# Altium schematic sheet PCB_tete_v1.SchDoc
size A4
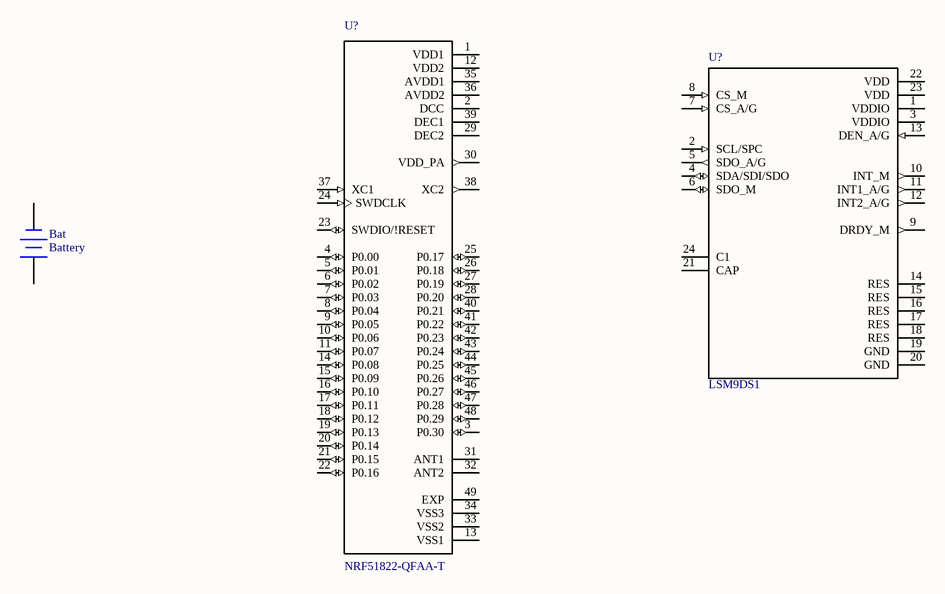
[diagram p0: PCB_tete_v1.SchDoc]

## Parts
(Parts that share a designator on the sheet are numbered #1, #2 ... from top to bottom, then left to right.)
Bat  Battery  [BAT-2]
U?#1  LSM9DS1  [PQFN24P43_350X300X102L35X23N]
U?#2  NRF51822-QFAA-T  [QFN40P600X600X90-49N]

## Nets

Not connected (* = marked no-connect by the designer): Bat 1(+) 2(-); U?#1 1(VDDIO) 2(SCL/SPC) 3(VDDIO) 4(SDA/SDI/SDO) 5(SDO_A/G) 6(SDO_M) 7(CS_A/G) 8(CS_M) 9(DRDY_M) 10(INT_M) 11(INT1_A/G) 12(INT2_A/G) 13(DEN_A/G) 14(RES) 15(RES) 16(RES) 17(RES) 18(RES) 19(GND) 20(GND) 21(CAP) 22(VDD) 23(VDD) 24(C1); U?#2 1(VDD1) 2(DCC) 3(P0.30) 4(P0.00) 5(P0.01) 6(P0.02) 7(P0.03) 8(P0.04) 9(P0.05) 10(P0.06) 11(P0.07) 12(VDD2) 13(VSS1) 14(P0.08) 15(P0.09) 16(P0.10) 17(P0.11) 18(P0.12) 19(P0.13) 20(P0.14) 21(P0.15) 22(P0.16) 23(SWDIO/!RESET) 24(SWDCLK) 25(P0.17) 26(P0.18) 27(P0.19) 28(P0.20) 29(DEC2) 30(VDD_PA) 31(ANT1) 32(ANT2) 33(VSS2) 34(VSS3) 35(AVDD1) 36(AVDD2) 37(XC1) 38(XC2) 39(DEC1) 40(P0.21) 41(P0.22) 42(P0.23) 43(P0.24) 44(P0.25) 45(P0.26) 46(P0.27) 47(P0.28) 48(P0.29) 49(EXP)

## Library data of the parts
Bat = Battery: Multicell Battery; Published: 24-Mar-1999; LatestRevisionDate: 17-Jul-2002; LatestRevisionNote: Re-released for DXP Platform.; PackageReference: BAT-2; Publisher: Altium Limited; PackageDescription: Battery; 2 Leads
U?#1 = LSM9DS1: iNEMO inertial module: 3D accelerometer, 3D gyroscope, 3D magnetometer; MF: STMicroelectronics; Price: None; Availability: Unavailable; Package: None; MP: LSM9DS1; Value: *
U?#2 = NRF51822-QFAA-T: IC RF TXRX+MCU BLUETOOTH 48VFQFN; MF: Nordic; Package: VFQFN-48 Nordic Semiconductor; MP: NRF51822-QFAA-T; Availability: Good; Price: 3.18 USD; Value: *